# EAGLE design 74lvc_ring_osc (EAGLE 9.2.2)
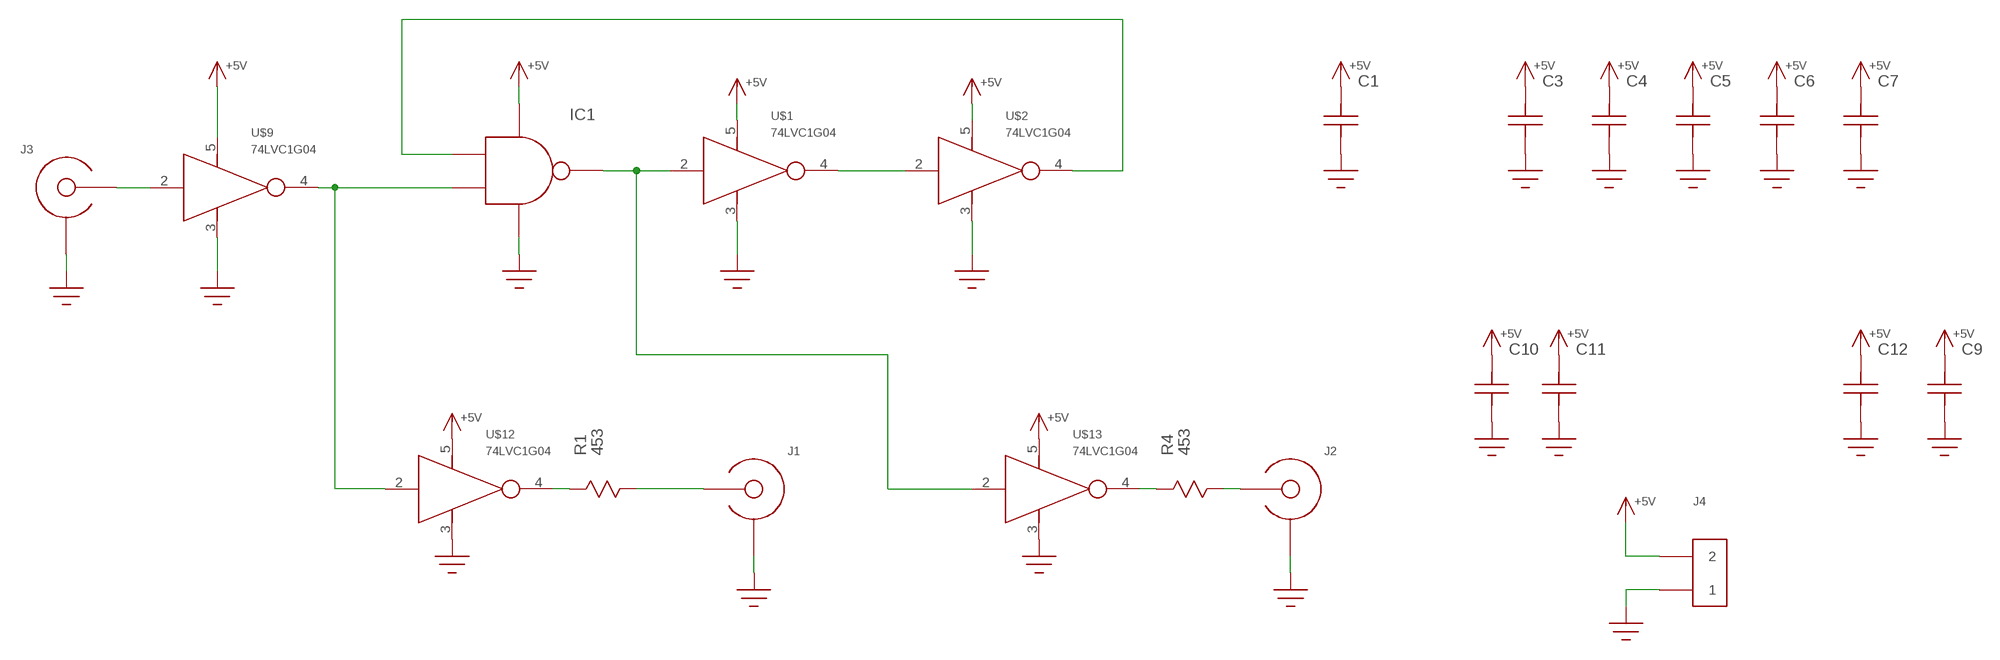
[diagram p0: schematic, sheet 1]

## Parts
C1  C0603  [C0603]
C3  C0603  [C0603]
C4  C0603  [C0603]
C5  C0603  [C0603]
C6  C0603  [C0603]
C7  C0603  [C0603]
C9  C1206  [1206]
C10  C0805  [0805]
C11  C0805  [0805]
C12  C1206  [1206]
IC1  74LVC1G00  [SOT23-5]
J1  EDGE_LAUNCH_JACK  [EDGE_LAUNCH_RF_CON]
J2  EDGE_LAUNCH_JACK  [EDGE_LAUNCH_RF_CON]
J3  EDGE_LAUNCH_JACK  [EDGE_LAUNCH_RF_CON]
J4  HEADER_2PIN  [HEADER_2PIN]
R1  453  R0805  [R0805]
R4  453  R0805  [R0805]
U$1  74LVC1G04  [SOT23-5]
U$2  74LVC1G04  [SOT23-5]
U$9  74LVC1G04  [SOT23-5]
U$12  74LVC1G04  [SOT23-5]
U$13  74LVC1G04  [SOT23-5]

## Nets
+5V: C1.P$2 C3.P$2 C4.P$2 C5.P$2 C6.P$2 C7.P$2 C9.P$2 C10.P$2 C11.P$2 C12.P$2 IC1.5(VCC) J4.2 U$1.5(VCC) U$2.5(VCC) U$9.5(VCC) U$12.5(VCC) U$13.5(VCC)
GND: C1.P$1 C3.P$1 C4.P$1 C5.P$1 C6.P$1 C7.P$1 C9.P$1 C10.P$1 C11.P$1 C12.P$1 IC1.3(GND) J1.GND@1(SHIELD) J1.GND@2(SHIELD) J1.GND@3(SHIELD) J1.GND@4(SHIELD) J1.GND@5(SHIELD) J1.GND@6(SHIELD) J1.GND@7(SHIELD) J1.GND@8(SHIELD) J1.GND@9(SHIELD) J1.GND@10(SHIELD) J1.GND@11(SHIELD) J1.GND@12(SHIELD) J1.SHIELD@1(SHIELD) J1.SHIELD@2(SHIELD) J2.GND@1(SHIELD) J2.GND@2(SHIELD) J2.GND@3(SHIELD) J2.GND@4(SHIELD) J2.GND@5(SHIELD) J2.GND@6(SHIELD) J2.GND@7(SHIELD) J2.GND@8(SHIELD) J2.GND@9(SHIELD) J2.GND@10(SHIELD) J2.GND@11(SHIELD) J2.GND@12(SHIELD) J2.SHIELD@1(SHIELD) J2.SHIELD@2(SHIELD) J3.GND@1(SHIELD) J3.GND@2(SHIELD) J3.GND@3(SHIELD) J3.GND@4(SHIELD) J3.GND@5(SHIELD) J3.GND@6(SHIELD) J3.GND@7(SHIELD) J3.GND@8(SHIELD) J3.GND@9(SHIELD) J3.GND@10(SHIELD) J3.GND@11(SHIELD) J3.GND@12(SHIELD) J3.SHIELD@1(SHIELD) J3.SHIELD@2(SHIELD) J4.1 U$1.3(GND) U$2.3(GND) U$9.3(GND) U$12.3(GND) U$13.3(GND)
N$1: IC1.4(Y) U$1.2(IN) U$13.2(IN)
N$2: U$1.4(OUT) U$2.2(IN)
N$3: IC1.2(A) U$2.4(OUT)
N$4: IC1.1(B) U$9.4(OUT) U$12.2(IN)
N$5: R1.P$1 U$12.4(OUT)
N$7: R4.P$1 U$13.4(OUT)
N$9: J3.CENTER U$9.2(IN)
N$10: J2.CENTER R4.P$2
N$11: J1.CENTER R1.P$2

## Library data of the parts
C1 C3-C7 C9-C12 = yapo:C
IC1 = yapo:74LVC1G00
J1-J3 = yapo:EDGE_LAUNCH_JACK
J4 = yapo:HEADER_2PIN
R1 R4 = yapo:R
U$1 U$2 U$9 U$12 U$13 = yapo:74LVC1G04

## Board
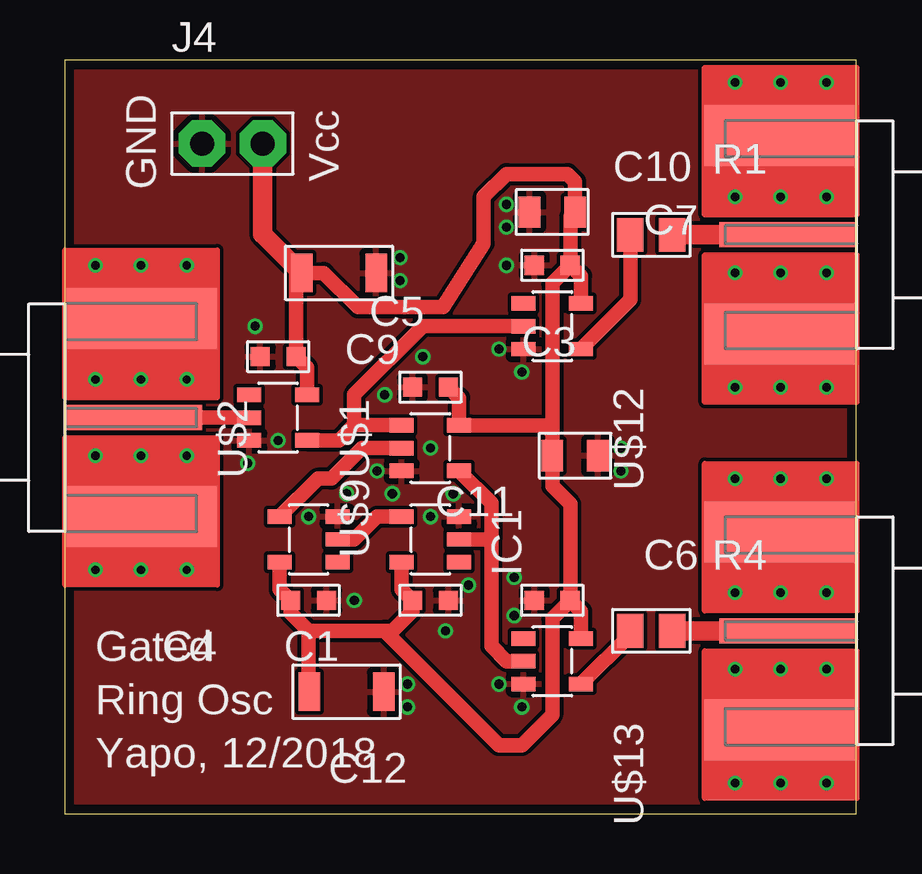
[diagram p1: board, top side]
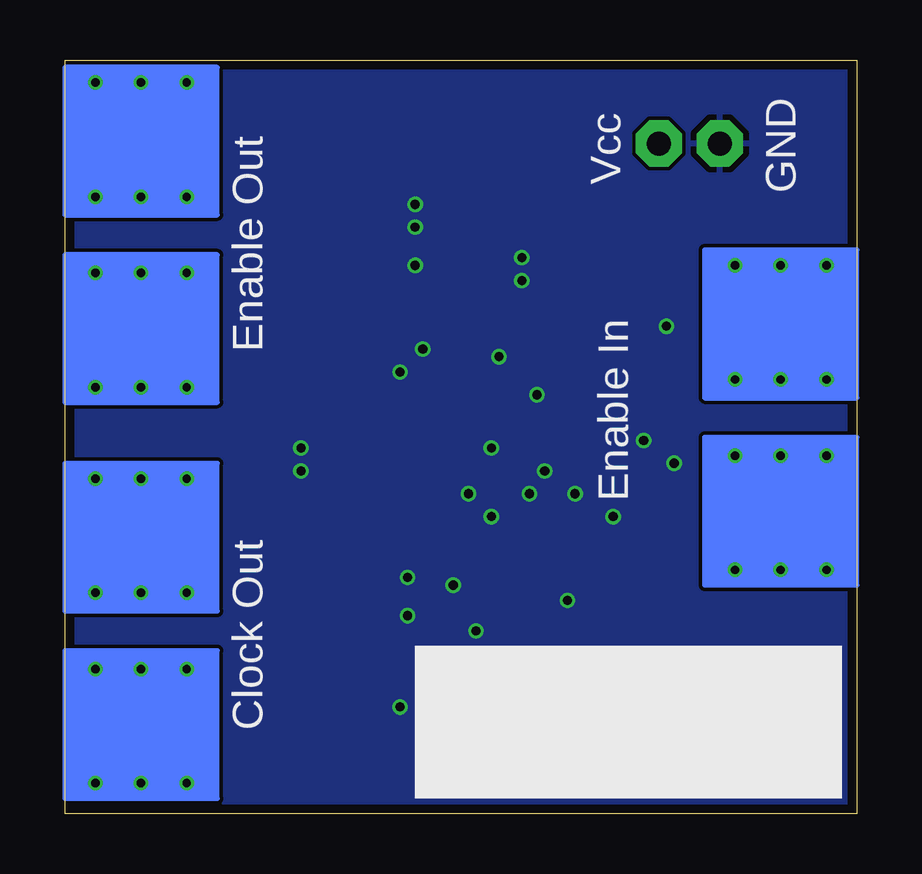
[diagram p2: board, bottom side, seen from below]

Size 33 x 31.42 mm. Coordinates in mm from the lower left corner, seen from the top.
Outline: 0,0 33,0 33,31.42 0,31.42 0,0
Copper layers (1*16): Top 0.035559375mm / dielectric 1.6mm / Bottom 0.035559375mm
Design rules "oshpark-2layer *": minimum track width 6mil, minimum drill 10mil, track to track 6mil, track to pad 6mil, pad to pad 6mil, via to via 6mil, smd to smd 6mil, copper to edge 15mil, drill to drill 6mil, minimum pad ring 5mil, minimum via ring 5mil, stop-mask expansion 2.5mil, vias tented up to drill 20mil, thermal gap 10mil

### Footprints (pad centres in the part's own frame; a part is rotated, then mirrored left to right if it is on the bottom)
C0603 = smd 0.8 x 0.8: P$1 -0.75,0; P$2 0.75,0
1206 = smd 0.9 x 1.6: P$1 -1.55,0; P$2 1.55,0
0805 = smd 0.9 x 1.3: P$1 -0.95,0; P$2 0.95,0
SOT23-5 = smd 0.6 x 1: 1 -0.95,-1.2; 2 0,-1.2; 3 0.95,-1.2; 4 0.95,1.2; 5 -0.95,1.2
EDGE_LAUNCH_RF_CON = smd 5.715 x 1.041: CENTER -2.875,0 | drill 0.35: GND@1 -5.08,1.587; GND@2 -3.175,1.587; GND@3 -1.27,1.587; GND@4 -5.08,-1.587; GND@5 -3.175,-1.587; GND@6 -1.27,-1.587; GND@7 -5.08,6.35; GND@8 -3.175,6.35; GND@9 -1.27,6.35; GND@10 -5.08,-6.35; GND@11 -3.175,-6.35; GND@12 -1.27,-6.35 | smd 6.35 x 2.54: SHIELD@1 -3.175,-4.128; SHIELD@2 -3.175,4.128
HEADER_2PIN = drill 1 pad 1.93 octagon: 1 -1.27,0; 2 1.27,0
R0805 = smd 1.1 x 1.4: P$1 -0.875,0; P$2 0.875,0

### Placement (x,y rotation side)
C1  15.24,8.89 180 top
C3  15.24,17.78 0 top
C4  10.16,8.89 180 top
C5  8.89,19.05 0 top
C6  20.32,8.89 0 top
C7  20.32,22.86 0 top
C9  11.43,22.54 180 top
C10  20.32,25.08 0 top
C11  21.27,14.92 180 top
C12  11.75,5.08 180 top
IC1  15.24,15.24 270 top
J1  33.02,24.13 0 top
J2  33.02,7.62 0 top
J3  0,16.51 180 top
J4  6.99,27.94 0 top
R1  24.45,24.13 0 top
R4  24.45,7.62 0 top
U$1  15.24,11.43 90 top
U$2  10.16,11.43 90 top
U$9  8.89,16.51 270 top
U$12  20.32,20.32 270 top
U$13  20.32,6.35 270 top

### Tracks (layer width: path | path; a pad name or v marks a point on that pad's centre or on a via)
+5V
  Top 0.61: U$2.5 8.96,9.34 C4.P$2 9.41,8.37 10.16,7.62 | U$1.5 14.04,9.34 C1.P$2 14.49,8.46 13.65,7.62 13.34,7.62 | C3.P$2 16.44,17.33 IC1.5 20.01,16.19 20.32,15.88 | U$9.5 10.09,18.6 C5.P$2 9.64,22.54 C9.P$2 10.79,22.54 12.22,21.11 15.77,21.11 17.46,23.77 17.46,25.72 18.41,26.67 20.95,26.67 21.27,26.36 C10.P$2 21.07,24.88 C7.P$2 | C6.P$2 21.52,8.44 U$13.5 | U$12.5 21.52,22.41 C7.P$2 | 10.16,7.62 13.34,7.62 | 13.34,7.62 18.1,2.86 19.05,2.86 20.32,4.13 20.32,8.14 C6.P$2 | C7.P$2 20.32,22.11 20.32,15.88 | 20.32,15.88 C11.P$2 20.32,13.65 21.07,12.9 C6.P$2 | C12.P$2 10.16,5.12 10.16,7.62
  Top 0.813: J4.2 8.26,24.17 C9.P$2
GND  (via drill 0.38)
  other vias: 18.73,8.26 10.16,12.38 15.24,12.38 15.24,15.24 8.89,15.56 19.05,18.41 18.1,5.4 13.65,13.34 16.83,9.53 23.18,15.24 23.18,14.29 12.06,8.89 11.75,13.34 13.02,14.29 7.62,14.61 7.94,20.32 19.05,4.45 15.88,7.62 18.1,19.37 18.41,22.86 16.19,13.34 18.73,9.84 13.97,23.18 13.97,22.23 18.41,25.4 18.41,24.45 14.29,5.4 14.29,4.45 14.92,19.05 13.34,17.46
  pour Top: 0,31.75 33.02,31.75 33.02,0 0,0
  pour Bottom: 0,31.43 33.02,31.43 33.34,31.43 33.34,0 0,0 0,0.32
N$1
  Top 0.61: 17.78,11.43 U$1.2 | U$13.2 18.41,6.35 17.78,6.99 17.78,11.43 | IC1.4 17.78,12.95 17.78,11.43
N$2
  Top 0.61: U$2.2 12.06,11.43 13.02,12.38 U$1.4
N$3
  Top 0.61: IC1.2 12.38,15.24 11.11,13.97 10.55,13.97 U$2.4
N$4
  Top 0.61: U$9.4 11.43,15.56 12.06,16.19 | 12.06,16.19 IC1.1 | U$12.2 14.92,20.32 12.06,17.46 12.06,16.19
N$5
  Top 0.61: U$12.4 23.57,21.42 R1.P$1
N$7
  Top 0.61: U$13.4 23.57,7.45 R4.P$1
N$9
  Top 0.61: U$9.2 J3.CENTER
N$10
  Top 0.813: J2.CENTER R4.P$2
N$11
  Top 0.813: J1.CENTER R1.P$2

### Text on the board
tPlace: GND | Vcc | Gated | Ring Osc | Yapo, 12/2018
bPlace: GND | Vcc | Enable Out | Enable In | Clock Out